# Altium schematic sheet Teensy 3.2 Adapter Board.SchDoc
size B
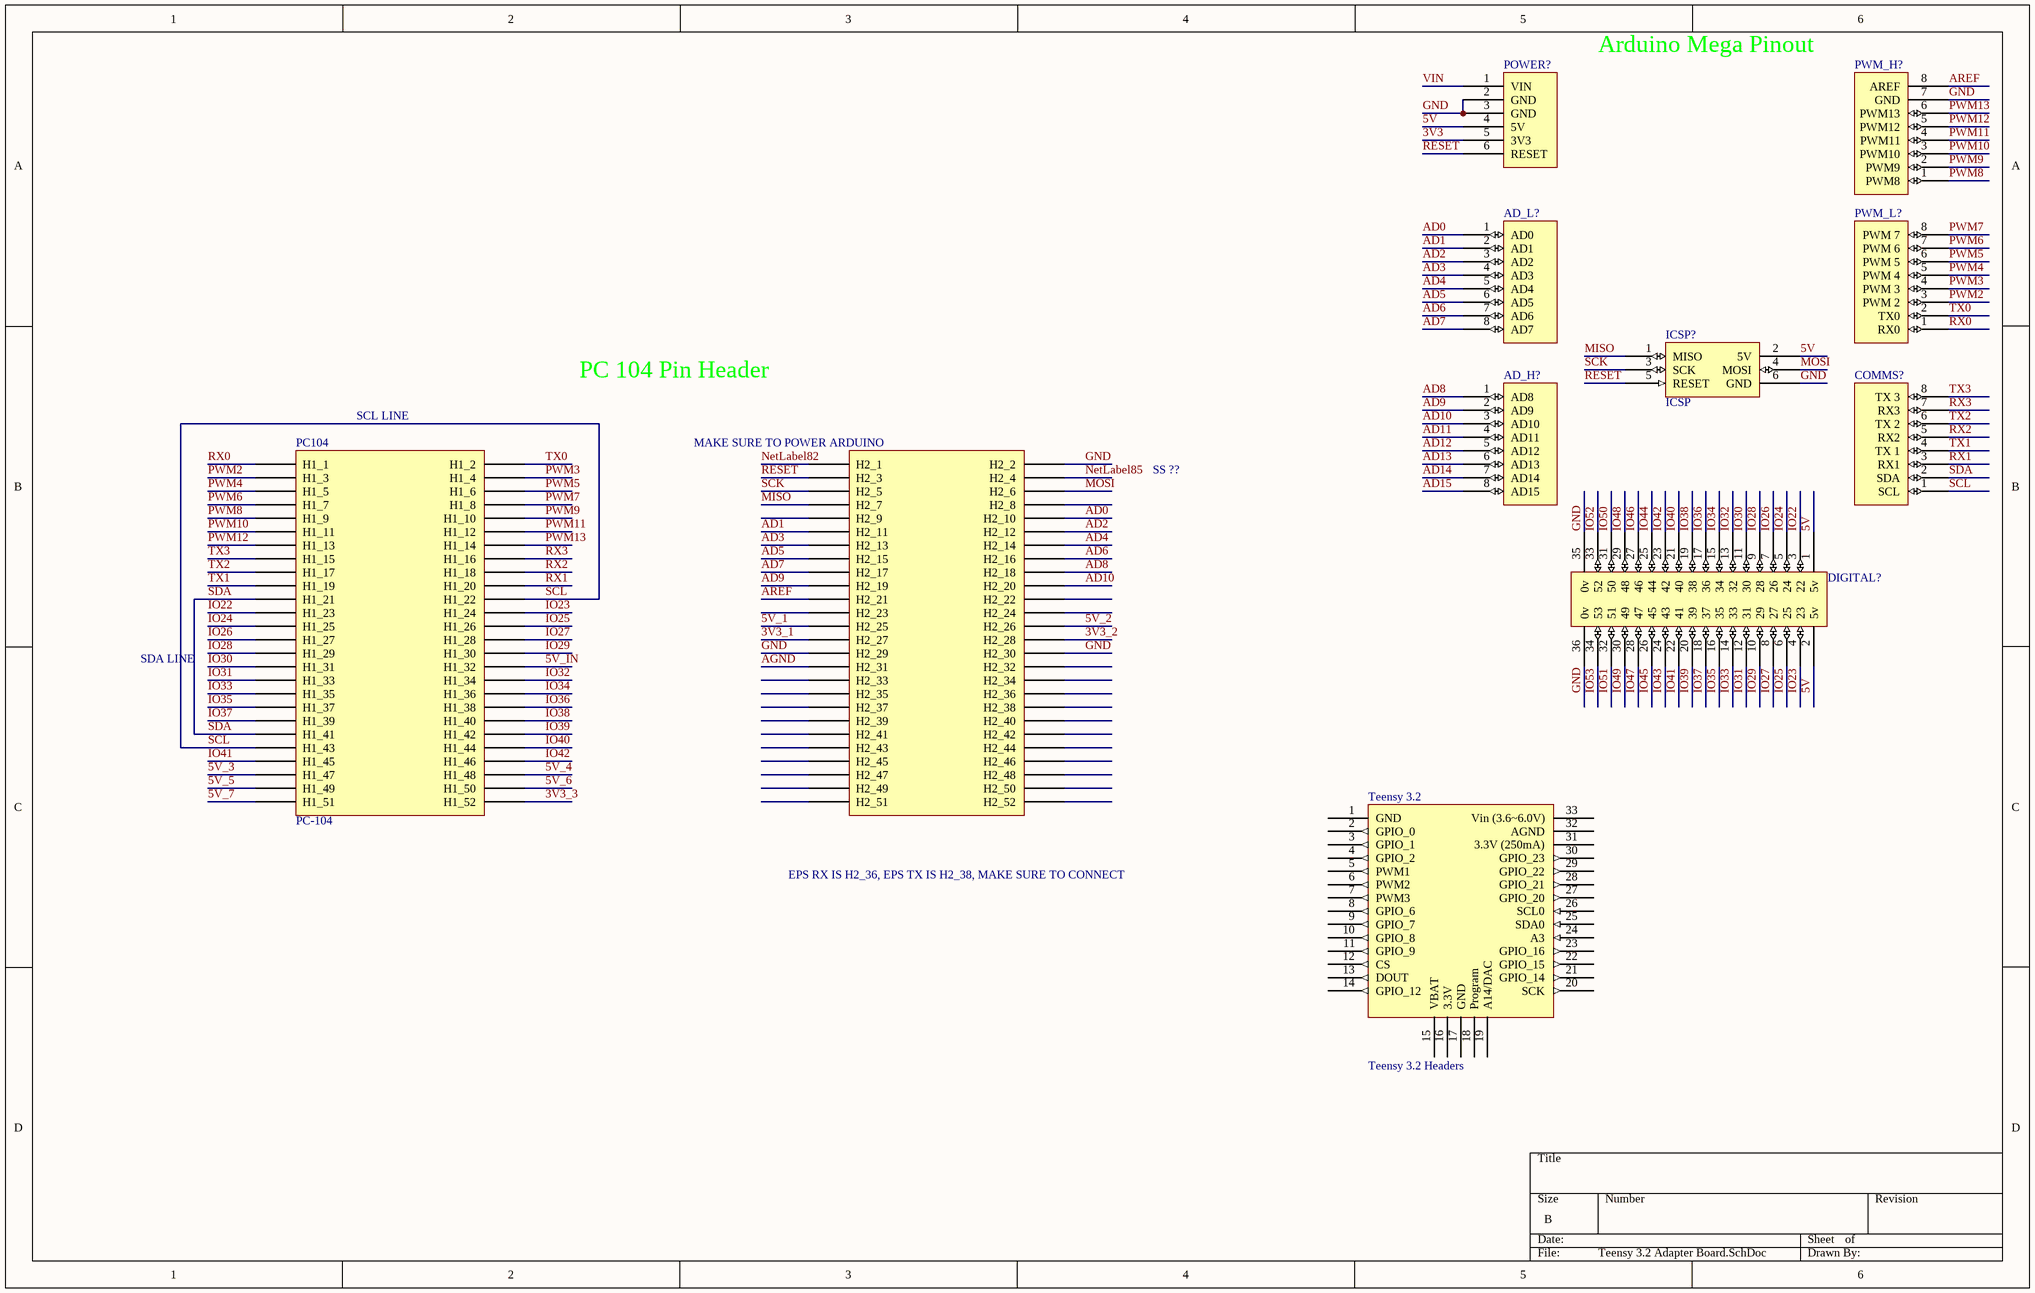
[diagram p0: Teensy 3.2 Adapter Board.SchDoc]

## Parts
AD_H?  AD_H  [Header 8x1 8.5mm]  (value not drawn)
AD_L?  AD_L  [Header 8x1 8.5mm]  (value not drawn)
COMMS?  Communication  [Header 8x1 8.5mm]  (value not drawn)
DIGITAL?  IO_36  [HEADER 36X 8MM]  (value not drawn)
ICSP?  ICSP  [ICSP]
PC104  PC-104  [PC-104FOOTPRINT]
POWER?  POWER  [Header 6x1 8.5mm]  (value not drawn)
PWM_H?  PWM_H  [Header 8x1 8.5mm]  (value not drawn)
PWM_L?  PWM_L  [Header 8x1 8.5mm]  (value not drawn)
Teensy_3.2  Teensy 3.2 Headers  [Teensy 3.2 SMD Headers]

## Nets
3V3: POWER?.5(3V3)
3V3_1: PC104.H2_27
3V3_2: PC104.H2_28
3V3_3: PC104.H1_52
5V: DIGITAL?.1(5v) DIGITAL?.2(5v) ICSP?.2(5V) POWER?.4(5V)
5V_1: PC104.H2_25
5V_2: PC104.H2_26
5V_3: PC104.H1_47
5V_4: PC104.H1_48
5V_5: PC104.H1_49
5V_6: PC104.H1_50
5V_7: PC104.H1_51
5V_IN: PC104.H1_32
AD0: AD_L?.1(AD0) PC104.H2_10
AD1: AD_L?.2(AD1) PC104.H2_11
AD2: AD_L?.3(AD2) PC104.H2_12
AD3: AD_L?.4(AD3) PC104.H2_13
AD4: AD_L?.5(AD4) PC104.H2_14
AD5: AD_L?.6(AD5) PC104.H2_15
AD6: AD_L?.7(AD6) PC104.H2_16
AD7: AD_L?.8(AD7) PC104.H2_17
AD8: AD_H?.1(AD8) PC104.H2_18
AD9: AD_H?.2(AD9) PC104.H2_19
AD10: AD_H?.3(AD10) PC104.H2_20
AD11: AD_H?.4(AD11)
AD12: AD_H?.5(AD12)
AD13: AD_H?.6(AD13)
AD14: AD_H?.7(AD14)
AD15: AD_H?.8(AD15)
AGND: PC104.H2_31
AREF: PC104.H2_21 PWM_H?.8(AREF)
GND: DIGITAL?.35(0v) DIGITAL?.36(0v) ICSP?.6(GND) PC104.H2_2 PC104.H2_29 PC104.H2_30 POWER?.2(GND) POWER?.3(GND) PWM_H?.7(GND)
IO22: DIGITAL?.3(22) PC104.H1_23
IO23: DIGITAL?.4(23) PC104.H1_24
IO24: DIGITAL?.5(24) PC104.H1_25
IO25: DIGITAL?.6(25) PC104.H1_26
IO26: DIGITAL?.7(26) PC104.H1_27
IO27: DIGITAL?.8(27) PC104.H1_28
IO28: DIGITAL?.9(28) PC104.H1_29
IO29: DIGITAL?.10(29) PC104.H1_30
IO30: DIGITAL?.11(30) PC104.H1_31
IO31: DIGITAL?.12(31) PC104.H1_33
IO32: DIGITAL?.13(32) PC104.H1_34
IO33: DIGITAL?.14(33) PC104.H1_35
IO34: DIGITAL?.15(34) PC104.H1_36
IO35: DIGITAL?.16(35) PC104.H1_37
IO36: DIGITAL?.17(36) PC104.H1_38
IO37: DIGITAL?.18(37) PC104.H1_39
IO38: DIGITAL?.19(38) PC104.H1_40
IO39: DIGITAL?.20(39) PC104.H1_42
IO40: DIGITAL?.21(40) PC104.H1_44
IO41: DIGITAL?.22(41) PC104.H1_45
IO42: DIGITAL?.23(42) PC104.H1_46
IO43: DIGITAL?.24(43)
IO44: DIGITAL?.25(44)
IO45: DIGITAL?.26(45)
IO46: DIGITAL?.27(46)
IO47: DIGITAL?.28(47)
IO48: DIGITAL?.29(48)
IO49: DIGITAL?.30(49)
IO50: DIGITAL?.31(50)
IO51: DIGITAL?.32(51)
IO52: DIGITAL?.33(52)
IO53: DIGITAL?.34(53)
MISO: ICSP?.1(MISO) PC104.H2_7
MOSI: ICSP?.4(MOSI) PC104.H2_6
NetLabel82: PC104.H2_1
NetLabel85: PC104.H2_4
PWM2: PC104.H1_3 PWM_L?.3(PWM_2)
PWM3: PC104.H1_4 PWM_L?.4(PWM_3)
PWM4: PC104.H1_5 PWM_L?.5(PWM_4)
PWM5: PC104.H1_6 PWM_L?.6(PWM_5)
PWM6: PC104.H1_7 PWM_L?.7(PWM_6)
PWM7: PC104.H1_8 PWM_L?.8(PWM_7)
PWM8: PC104.H1_9 PWM_H?.1(PWM8)
PWM9: PC104.H1_10 PWM_H?.2(PWM9)
PWM10: PC104.H1_11 PWM_H?.3(PWM10)
PWM11: PC104.H1_12 PWM_H?.4(PWM11)
PWM12: PC104.H1_13 PWM_H?.5(PWM12)
PWM13: PC104.H1_14 PWM_H?.6(PWM13)
RESET: ICSP?.5(RESET) PC104.H2_3 POWER?.6(RESET)
RX0: PC104.H1_1 PWM_L?.1(RX0)
RX1: COMMS?.3(RX1) PC104.H1_20
RX2: COMMS?.5(RX2) PC104.H1_18
RX3: COMMS?.7(RX3) PC104.H1_16
SCK: ICSP?.3(SCK) PC104.H2_5
SCL: COMMS?.1(SCL) PC104.H1_22 PC104.H1_43
SDA: COMMS?.2(SDA) PC104.H1_21 PC104.H1_41
TX0: PC104.H1_2 PWM_L?.2(TX0)
TX1: COMMS?.4(TX_1) PC104.H1_19
TX2: COMMS?.6(TX_2) PC104.H1_17
TX3: COMMS?.8(TX_3) PC104.H1_15
VIN: POWER?.1(VIN)

Not connected (* = marked no-connect by the designer): PC104 H2_8 H2_9 H2_22 H2_23 H2_24 H2_32 H2_33 H2_34 H2_35 H2_36 H2_37 H2_38 H2_39 H2_40 H2_41 H2_42 H2_43 H2_44 H2_45 H2_46 H2_47 H2_48 H2_49 H2_50 H2_51 H2_52; Teensy_3.2 1(GND) 2(GPIO_0) 3(GPIO_1) 4(GPIO_2) 5(PWM1) 6(PWM2) 7(PWM3) 8(GPIO_6) 9(GPIO_7) 10(GPIO_8) 11(GPIO_9) 12(CS) 13(DOUT) 14(GPIO_12) 15(VBAT) 16(3.3V) 17(GND) 18(Program) 19(A14/DAC) 20(SCK) 21(GPIO_14) 22(GPIO_15) 23(GPIO_16) 24(A3) 25(SDA0) 26(SCL0) 27(GPIO_20) 28(GPIO_21) 29(GPIO_22) 30(GPIO_23) 31(3.3V_(250mA)) 32(AGND) 33(Vin_(3.6~6.0V))

## Notes on the sheet
- Arduino Mega Pinout
- PC 104 Pin Header
- (near PC104) SCL LINE
- (near PC104) MAKE SURE TO POWER ARDUINO
- SS ??
- SDA LINE
- EPS RX IS H2_36, EPS TX IS H2_38, MAKE SURE TO CONNECT